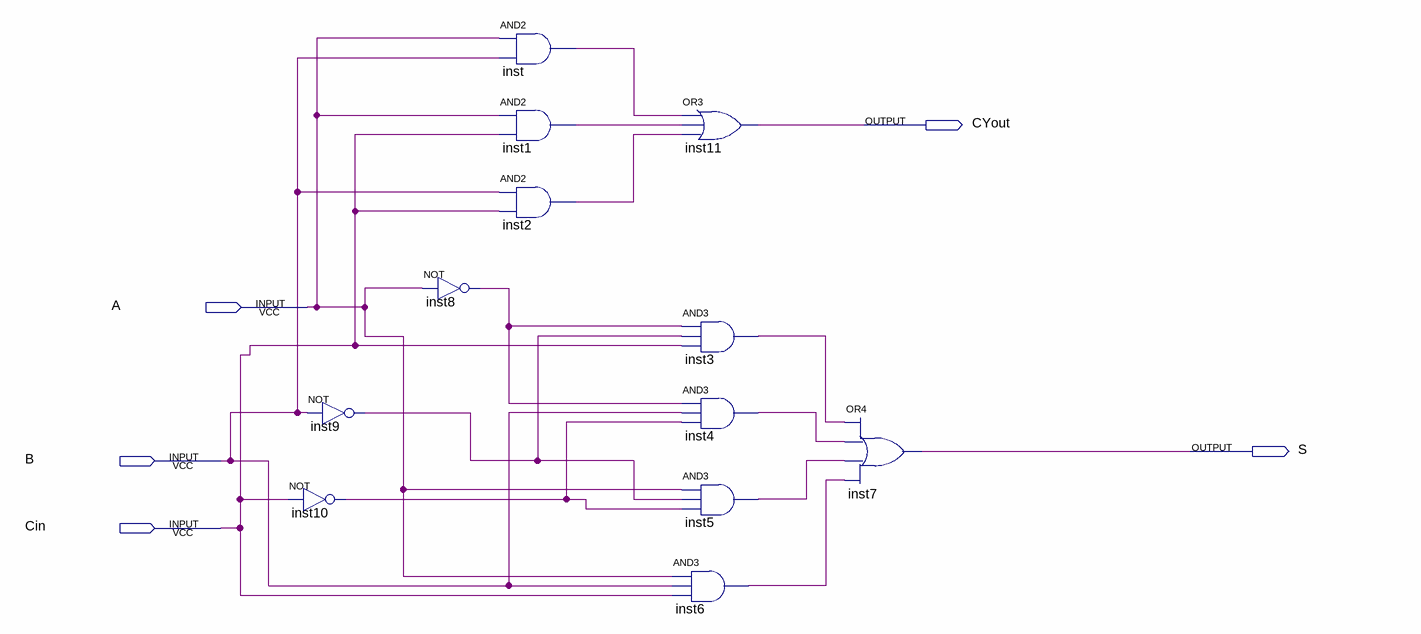
[diagram p0: schematic sheet]
// Quartus schematic Sumador_completo.bdf as structural Verilog: 12 symbols, 5 pins
module Sumador_completo (
  input  A,
  input  B,
  input  Cin,
  output CYout,
  output S
);

  wire inst1_out, inst2_out, inst3_out, inst4_out, inst5_out, inst6_out, inst8_out, inst9_out, inst10_out,
       inst_out;

  not inst9 (inst9_out, B);
  not inst10 (inst10_out, Cin);
  not inst8 (inst8_out, A);
  and inst (inst_out, A, B);
  and inst1 (inst1_out, A, Cin);
  and inst2 (inst2_out, B, Cin);
  or inst11 (CYout, inst_out, inst1_out, inst2_out);
  and inst3 (inst3_out, inst8_out, inst9_out, Cin);
  and inst4 (inst4_out, inst8_out, B, inst10_out);
  and inst5 (inst5_out, A, inst9_out, inst10_out);
  and inst6 (inst6_out, A, B, Cin);
  or inst7 (S, inst3_out, inst4_out, inst5_out, inst6_out);
endmodule
